# Altium schematic sheet dcdc_converter.SchDoc: foxBMS BMS-Slave 12-Cell
size A3; DocumentNumber: 15; SheetNumber: 15; SheetTotal: 15; AUTHOR: Fraunhofer IISB foxBMS Team; SheetDescription: DC/DC Converter
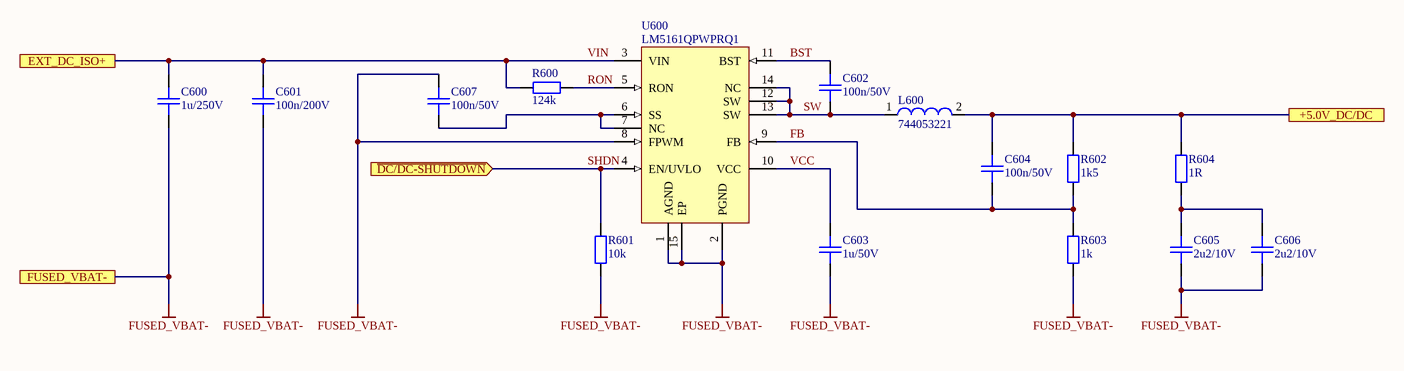
[diagram p0: dcdc_converter.SchDoc]

## Parts
C600  1u/250V  [CAPC4532X16N]
C601  100n/200V  [CAPC3216X18N]
C602  100n/50V  [CAPC1608X08N]
C603  1u/50V  [CAPC2012X14N]
C604  100n/50V  [CAPC1608X08N]
C605  2u2/10V  [CAPC2012X14N]
C606  2u2/10V  [CAPC2012X14N]
C607  100n/50V  [CAPC1608X08N]
L600  744053221  [WE-TPC-5828-LH]
R600  124k  [RESC1608X05N]
R601  10k  [RESC1608X05N]
R602  1k5  [RESC1608X05N]
R603  1k  [RESC1608X05N]
R604  1R  [RESC2012X05N]
U600  LM5161QPWPRQ1  [PWP0014A]

## Ports
+5.0V_DC/DC, EXT_DC_ISO+, FUSED_VBAT-, ~{DC/DC-SHUTDOWN} (in)

## Nets
FUSED_VBAT-: C600.1 C601.1 C603.1 C605.1 C606.1 C607.2 R601.2 R603.2 U600.1(AGND) U600.2(PGND) U600.8(FPWM) U600.15(EP) ; port FUSED_VBAT-
+5.0V_DC/DC: C604.2 L600.2 R602.1 R604.1 ; port +5.0V_DC/DC
BST: C602.2 U600.11(BST)
FB: C604.1 R602.2 R603.1 U600.9(FB)
RON: R600.1 U600.5(RON)
SHDN: R601.1 U600.4(EN/UVLO) ; port ~{DC/DC-SHUTDOWN}
SW: C602.1 L600.1 U600.12(SW) U600.13(SW) U600.14(NC)
VCC: C603.2 U600.10(VCC)
VIN: C600.2 C601.2 R600.2 U600.3(VIN) ; port EXT_DC_ISO+
NetC605_2: C605.2 C606.2 R604.2
NetC607_1: C607.1 U600.6(SS) U600.7(NC)

## Notes on the sheet
- Fraunhofer IISB
- Schottkystr. 10
- developed by:
- 91058 Erlangen
- Germany
- Author
- Project
- License
- Description
- File
- Version
- Release Date
- Sheet
- www.foxbms.org
- www.iisb.fraunhofer.de
- foxBMS Team
- /

## Library data of the parts
C600 = gen_C_ceramic_1u_250V_X7R_1812: MLCC; Capacitance: 1u; Rated Voltage: 250V; Dielectric: X7T; Case EIA: 1812; Case Metric: 4532; Automotive Qualified: True; Part Number: gen_C_ceramic_1u_250V_X7R_1812; Supplier 1: Farnell; Supplier Part Number 1: 2435499
C601 = gen_C_ceramic_100n_200V_X7R_1206: MLCC; Capacitance: 100n; Rated Voltage: 200V; Dielectric: X7R; Case EIA: 1206; Case Metric: 3216; Automotive Qualified: True; Part Number: gen_C_ceramic_100n_200V_X7R_1206; Supplier 1: Farnell; Supplier Part Number 1: 2673161; Supplier 2: Farnell; Supplier Part Number 2: 2520773
C602 C604 C607 = gen_C_ceramic_100n_50V_X7R_0603: MLCC; Capacitance: 100n; Rated Voltage: 50V; Dielectric: X7R; Case EIA: 0603; Case Metric: 1608; PnP Package: C_0603_10; PnP Value: 100n/50V/X7R; PnP equipped: x; Automotive Qualified: True; Part Number: gen_C_ceramic_100n_50V_X7R_0603; Supplier 1: Farnell; Supplier Part Number 1: 2525267; Supplier 2: Digikey; Supplier Part Number 2: 490-6049-1-ND; Supplier 3: Farnell; Supplier Part Number 3: 2070398
C603 = gen_C_ceramic_1u_50V_X7R_0805: MLCC; Capacitance: 1u; Rated Voltage: 50V; Dielectric: X7R; Case EIA: 0805; Case Metric: 2012; Automotive Qualified: True; Tolerance: ± 10%; AVT Set: x; Part Number: gen_C_ceramic_1u_50V_X7R_0805; Supplier 1: Farnell; Supplier Part Number 1: 2672199; Operating Temperature: -55°C - +125°C; Supplier 2: Farnell; Supplier Part Number 2: 2479894; Supplier 3: Farnell; Supplier Part Number 3: 2464630
C605 C606 = gen_C_ceramic_2u2_10V_X7R_0805: MLCC; Capacitance: 2u2; Rated Voltage: 10V; Dielectric: X7R; Case EIA: 0805; Case Metric: 2012; Automotive Qualified: True; Part Number: gen_C_ceramic_2u2_10V_X7R_0805; Supplier 1: Farnell; Supplier Part Number 1: 2478259; Supplier 2: Farnell; Supplier Part Number 2: 2070513
L600 = CMP-0227-00378-1: SMD Shielded Tiny Power Inductor WE-TPC, L = 220 µH; Inductance: 220 ÂµH; ComponentLink2URL: http://www.we-online.de/katalog/media/pdf/744053221.pdf; ComponentLink1URL: http://www.we-online.com; PackageVersion: 2010; ComponentLink2Description: Datasheet; DatasheetVersion: ver 8, Jan-2010; ComponentLink1Description: Manufacturer Link; PackageDescription: SMD Inductor, 2-Leads, Body 5.8 x 5.8 mm; PackageReference: WE-TPC-5828-LH
R600 = gen_R_124k_0603: SMD Resistor 124k 0603; Tolerance: 1%; Power: 0.1W; Case EIA: 0603; Case Metric: 1608; Maximum Working Voltage: 75V; PnP Package: R_0603; Automotive Qualified: True; Part Number: gen_R_124k_0603; Operating Temperature: -55°C - +155°C; Resistance: 124k; Series: E96; PnP Value: 124k; Supplier 1: Farnell; Supplier Part Number 1: 2138508
R601 = gen_R_10k_0603: SMD Resistor 10k 0603; Tolerance: 1%; Power: 0.1W; Case EIA: 0603; Case Metric: 1608; Maximum Working Voltage: 75V; PnP Package: R_0603; Automotive Qualified: True; Part Number: gen_R_10k_0603; Operating Temperature: -55°C - +155°C; Resistance: 10k; Series: E24, E96; PnP Value: 10k; Supplier 1: Farnell; Supplier Part Number 1: 2073349
R602 = gen_R_1k5_0603: SMD Resistor 1k5 0603; Tolerance: 1%; Power: 0.1W; Case EIA: 0603; Case Metric: 1608; Maximum Working Voltage: 75V; PnP Package: R_0603; Automotive Qualified: True; Part Number: gen_R_1k5_0603; Operating Temperature: -55°C - +155°C; Resistance: 1k5; Series: E24, E96; PnP Value: 1k5; Supplier 1: Farnell; Supplier Part Number 1: 2616745
R603 = gen_R_1k_0603: SMD Resistor 1k 0603; Tolerance: 1%; Power: 0.1W; Case EIA: 0603; Case Metric: 1608; Maximum Working Voltage: 75V; PnP Package: R_0603; Automotive Qualified: True; PnP equipped: x; Part Number: gen_R_1k_0603; Operating Temperature: -55°C - +155°C; Resistance: 1k; Series: E24, E96; PnP Value: 1k; Supplier 1: Farnell; Supplier Part Number 1: 1652848
R604 = gen_R_1R_0805: SMD Resistor 1R 0805; Tolerance: 1%; Power: 0.125W; Case EIA: 0805; Case Metric: 2012; Maximum Working Voltage: 150V; PnP Package: R_0805; Automotive Qualified: True; Part Number: gen_R_1R_0805; Operating Temperature: -55°C - +155°C; Resistance: 1R; Series: E24, E96; PnP Value: 1R; Supplier 1: Farnell; Supplier Part Number 1: 2616757
U600 = LM5161QPWPRQ1: Automotive DC/DC buck converter; Manufacturer: Texas Instruments; PnP Package: HTSSOP-14; Automotive Qualified: True; Part Number: LM5161QPWPRQ1; Part Name: LM5161QPWPRQ1; Operating Temperature: −40°C - +125°C; Supplier 1: Digikey; Supplier Part Number 1: 296-47791-1-ND; Supplier 2: Mouser; Supplier Part Number 2: 595-LM5161QPWPRQ1